# EAGLE design Digit-platus (EAGLE 5.07)
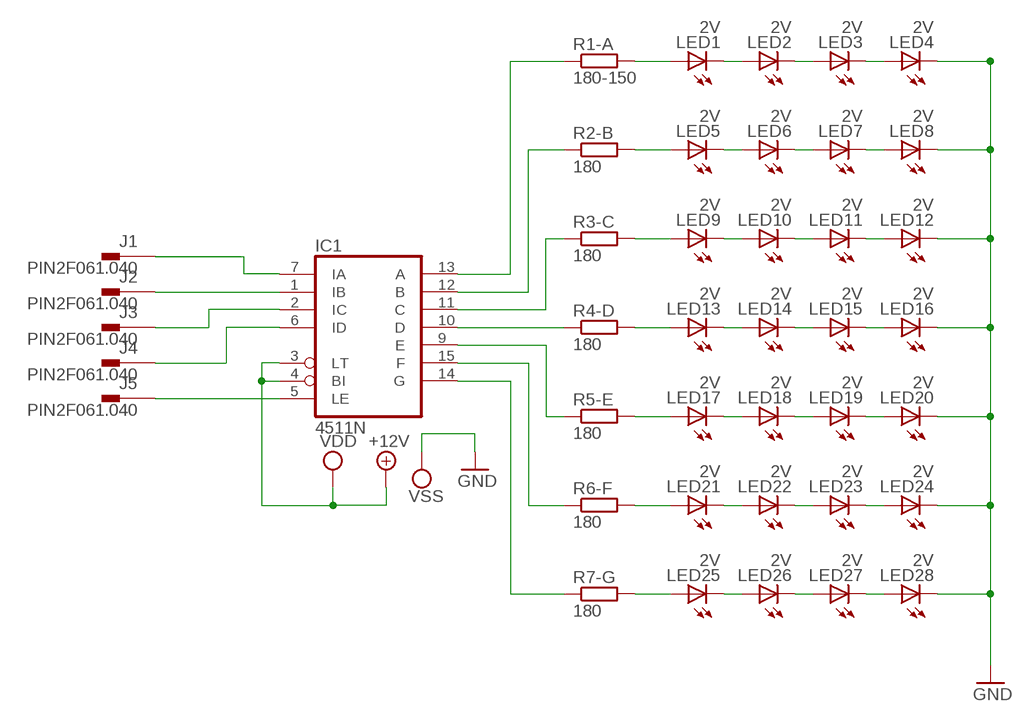
[diagram p0: schematic, sheet 1]

## Parts
IC1  4511N  [DIL16]
J1  PIN2F061.040  [F061.040]
J2  PIN2F061.040  [F061.040]
J3  PIN2F061.040  [F061.040]
J4  PIN2F061.040  [F061.040]
J5  PIN2F061.040  [F061.040]
LED1  2V  LED5MM  [LED5MM]
LED2  2V  LED5MM  [LED5MM]
LED3  2V  LED5MM  [LED5MM]
LED4  2V  LED5MM  [LED5MM]
LED5  2V  LED5MM  [LED5MM]
LED6  2V  LED5MM  [LED5MM]
LED7  2V  LED5MM  [LED5MM]
LED8  2V  LED5MM  [LED5MM]
LED9  2V  LED5MM  [LED5MM]
LED10  2V  LED5MM  [LED5MM]
LED11  2V  LED5MM  [LED5MM]
LED12  2V  LED5MM  [LED5MM]
LED13  2V  LED5MM  [LED5MM]
LED14  2V  LED5MM  [LED5MM]
LED15  2V  LED5MM  [LED5MM]
LED16  2V  LED5MM  [LED5MM]
LED17  2V  LED5MM  [LED5MM]
LED18  2V  LED5MM  [LED5MM]
LED19  2V  LED5MM  [LED5MM]
LED20  2V  LED5MM  [LED5MM]
LED21  2V  LED5MM  [LED5MM]
LED22  2V  LED5MM  [LED5MM]
LED23  2V  LED5MM  [LED5MM]
LED24  2V  LED5MM  [LED5MM]
LED25  2V  LED5MM  [LED5MM]
LED26  2V  LED5MM  [LED5MM]
LED27  2V  LED5MM  [LED5MM]
LED28  2V  LED5MM  [LED5MM]
R1-A  180-150  R-EU_0309/12  [0309/12]
R2-B  180  R-EU_0309/12  [0309/12]
R3-C  180  R-EU_0309/12  [0309/12]
R4-D  180  R-EU_0309/12  [0309/12]
R5-E  180  R-EU_0309/12  [0309/12]
R6-F  180  R-EU_0309/12  [0309/12]
R7-G  180  R-EU_0309/12  [0309/12]

## Nets
+12V: IC1.3(LT) IC1.4(BI) ; supply symbol labelled VDD
GND: LED4.K(C) LED8.K(C) LED12.K(C) LED16.K(C) LED20.K(C) LED24.K(C) LED28.K(C) ; supply symbol labelled VSS
N$1: LED1.A R1-A.2
N$2: LED1.K(C) LED2.A
N$3: LED2.K(C) LED3.A
N$4: LED3.K(C) LED4.A
N$5: LED5.A R2-B.2
N$6: LED5.K(C) LED6.A
N$7: LED6.K(C) LED7.A
N$8: LED7.K(C) LED8.A
N$9: LED9.A R3-C.2
N$10: LED9.K(C) LED10.A
N$11: LED10.K(C) LED11.A
N$12: LED11.K(C) LED12.A
N$13: LED13.A R4-D.2
N$14: LED13.K(C) LED14.A
N$15: LED14.K(C) LED15.A
N$16: LED15.K(C) LED16.A
N$17: LED17.A R5-E.2
N$18: LED17.K(C) LED18.A
N$19: LED18.K(C) LED19.A
N$20: LED19.K(C) LED20.A
N$21: LED21.A R6-F.2
N$22: LED21.K(C) LED22.A
N$23: LED22.K(C) LED23.A
N$24: LED23.K(C) LED24.A
N$25: LED25.A R7-G.2
N$26: LED25.K(C) LED26.A
N$27: LED26.K(C) LED27.A
N$28: LED27.K(C) LED28.A
N$29: IC1.13(A) R1-A.1
N$30: IC1.12(B) R2-B.1
N$31: IC1.11(C) R3-C.1
N$32: IC1.10(D) R4-D.1
N$33: IC1.9(E) R5-E.1
N$34: IC1.15(F) R6-F.1
N$35: IC1.14(G) R7-G.1
N$36: IC1.1(IB) J2.A1
N$37: IC1.7(IA) J1.A1
N$38: IC1.5(LE) J5.A1
N$39: IC1.2(IC) J3.A1
N$40: IC1.6(ID) J4.A1
Unconnected: J1.A2(1.1) J2.A2(1.1) J3.A2(1.1) J4.A2(1.1) J5.A2(1.1)

## Power pins joined to a net without a drawn wire
+12V: IC1.16(VDD)
GND: IC1.8(VSS)

## Library data of the parts
IC1 = 45xx:4511: BCD to 7-segment LATCH/DECODER/DRIVER
J1-J5 = con-faston:PIN2: Flachstecker Typ Tyco/Electronics/AMP TAB, FASTON Printed Circuit Board Tabs Source: http://www.buerklin.com, http://catalog.tycoelectronics.com
LED1-LED28 = led:LED: LED OSRAM: - CHIPLED LG R971, LG N971, LY N971, LG Q971, LY Q971, LO R971, LY R971 LH N974, LH R974 LS Q976, LO Q976, LY Q976 LO Q996 - Hyper CHIPLED LW Q18S LB Q993, LB Q99A, LB R99A - SideLED LS A670, LO A670, LY A670, LG A670, LP A670 LB A673, LV A673, LT A673, LW A673 LH A674 LY A675 LS A676, LA A676, LO A676, LY A676, LW A676 LS A679, LY A679, LG A679 - Hyper Micro SIDELED® LS Y876, LA Y876, LO Y876, LY Y876 LT Y87S - SmartLED LW L88C, LW L88S LB L89C, LB L89S, LG L890 LS L89K, LO L89K, LY L89K LS L896, LA L896, LO L896, LY L896 - TOPLED LS T670, LO T670, LY T670, LG T670, LP T670 LSG T670, LSP T670, LSY T670, LOP T670, LYG T670 LG T671, LOG T671, LSG T671 LB T673, LV T673, LT T673, LW T673 LH T674 LS T676, LA T676, LO T676, LY T676, LB T676, LH T676, LSB T676, LW T676 LB T67C, LV T67C, LT T67C, LS T67K, LO T67K, LY T67K, LW E67C LS E67B, LA E67B, LO E67B, LY E67B, LB E67C, LV E67C, LT E67C LW T67C LS T679, LY T679, LG T679 LS T770, LO T770, LY T770, LG T770, LP T770 LB T773, LV T773, LT T773, LW T773 LH T774 LS E675, LA E675, LY E675, LS T675 LS T776, LA T776, LO T776, LY T776, LB T776 LHGB T686 LT T68C, LB T68C - Hyper Mini TOPLED® LB M676 - Mini TOPLED Santana® LG M470 LS M47K, LO M47K, LY M47K Source: http://www.osram.convergy.de LUXEON: - LUMILED® LXK2-PW12-R00, LXK2-PW12-S00, LXK2-PW14-U00, LXK2-PW14-V00 LXK2-PM12-R00, LXK2-PM12-S00, LXK2-PM14-U00 LXK2-PE12-Q00, LXK2-PE12-R00, LXK2-PE12-S00, LXK2-PE14-T00, LXK2-PE14-U00 LXK2-PB12-K00, LXK2-PB12-L00, LXK2-PB12-M00, LXK2-PB14-N00, LXK2-PB14-P00, LXK2-PB14-Q00 LXK2-PR12-L00, LXK2-PR12-M00, LXK2-PR14-Q00, LXK2-PR14-R00 LXK2-PD12-Q00, LXK2-PD12-R00, LXK2-PD12-S00 LXK2-PH12-R00, LXK2-PH12-S00 LXK2-PL12-P00, LXK2-PL12-Q00, LXK2-PL12-R00 Source: www.luxeon.com KINGBRIGHT: KA-3528ASYC Source: www.kingbright.com
R1-A R2-B R3-C R4-D R5-E R6-F R7-G = ~~rcl:R-EU_: RESISTOR, European symbol

## Board
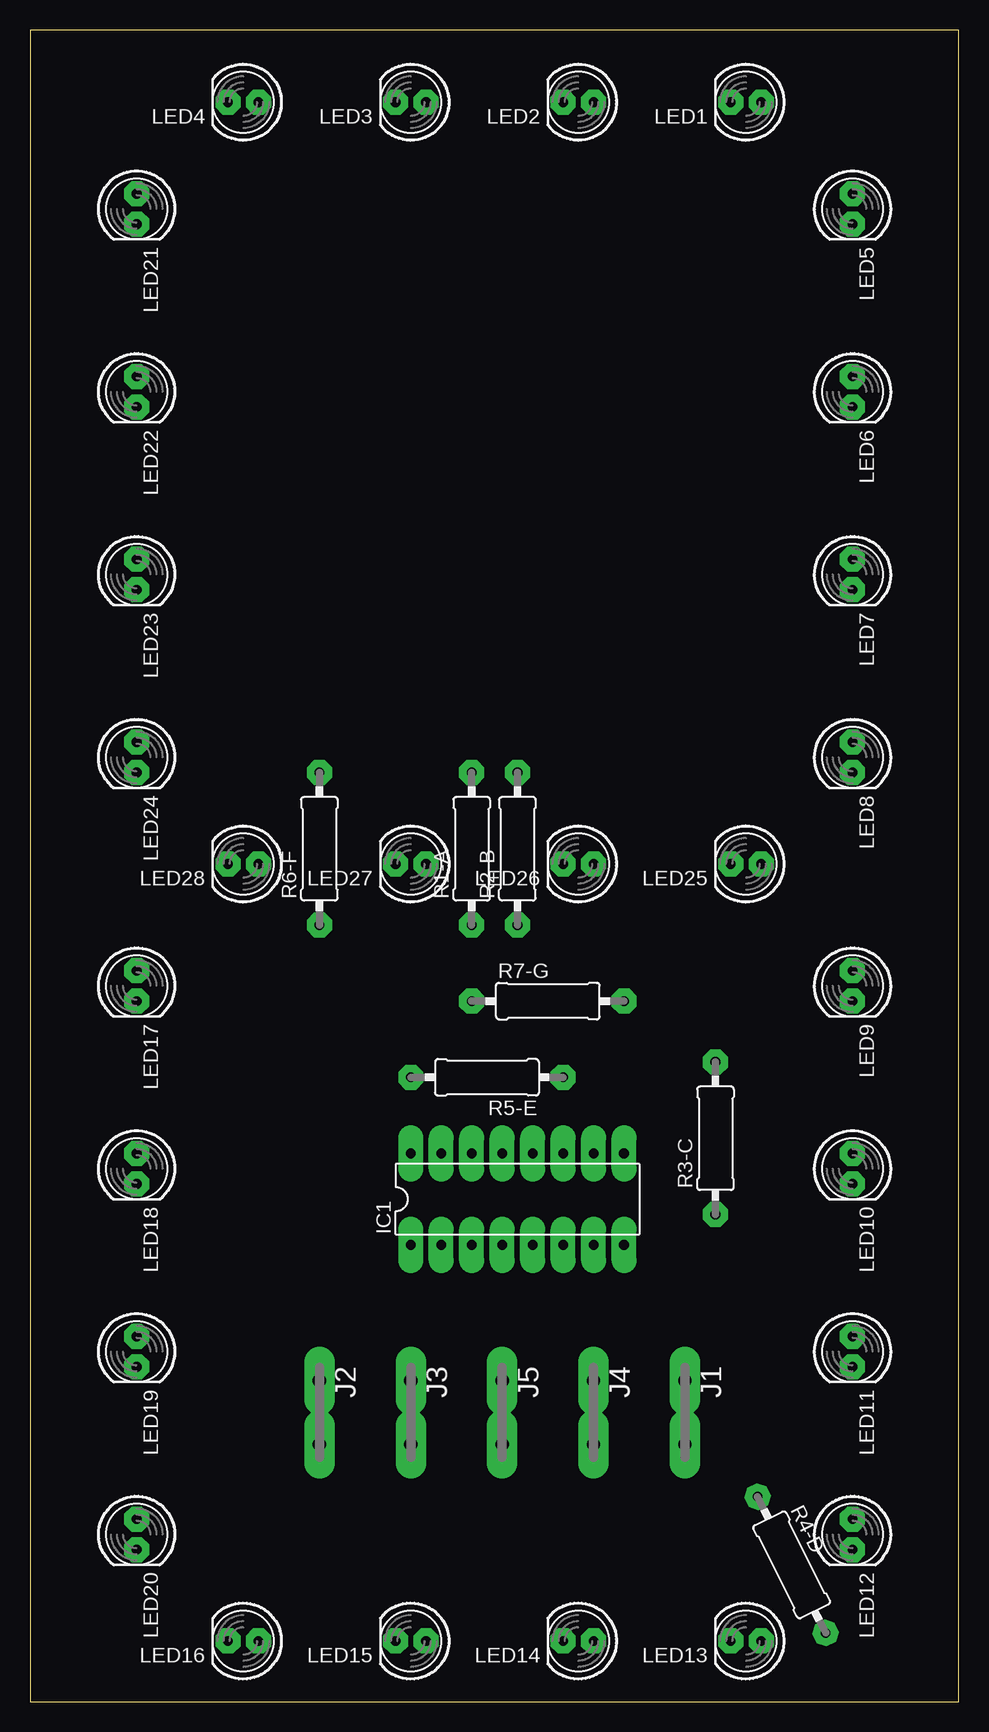
[diagram p1: board, top side]
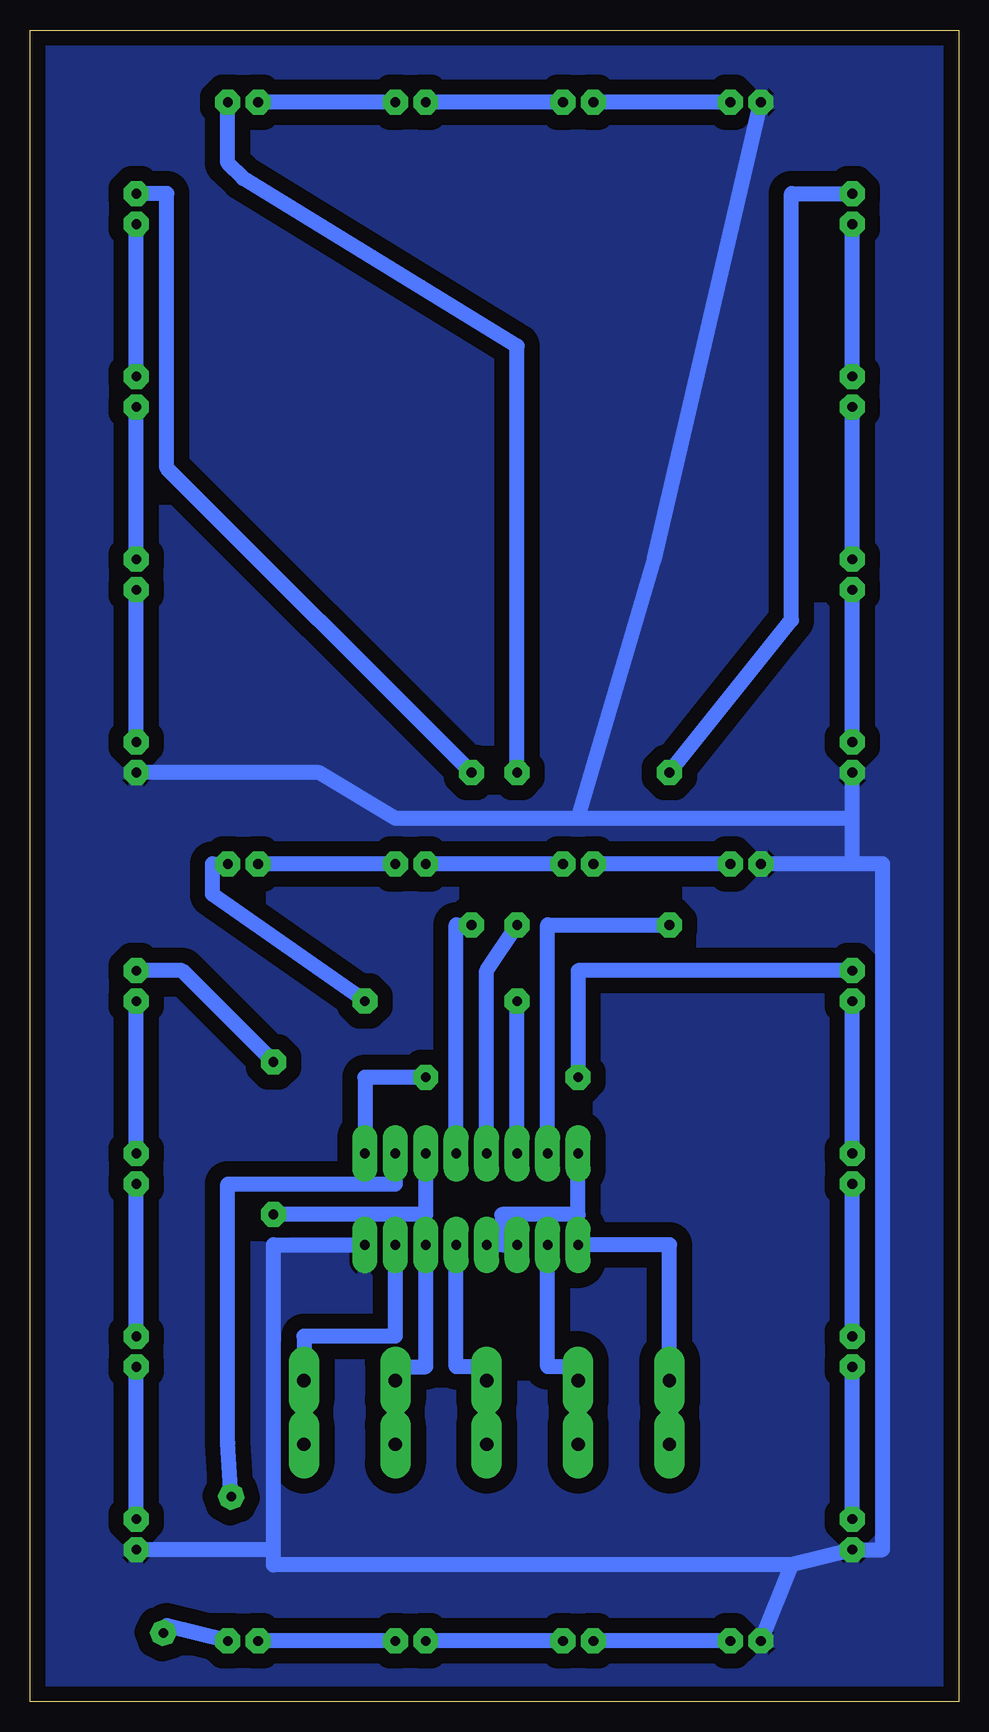
[diagram p2: board, bottom side, seen from below]

Size 77.45 x 139.37 mm. Coordinates in mm from the lower left corner, seen from the top.
Outline: 0,0 77.45,0 77.45,139.37 0,139.37 0,0
Copper layers (1*16): Top 0.035mm / dielectric 1.5mm / Bottom 0.035mm
Design rules "mano bandymas *": minimum track width 50mil, minimum drill 24mil, track to track 8mil, track to pad 8mil, pad to pad 8mil, via to via 8mil, smd to smd 8mil, copper to edge 40mil, drill to drill 8mil, minimum pad ring 25mil, minimum via ring 28mil, stop-mask expansion 4mil, vias tented up to drill 0mil, thermal gap 10mil

### Footprints (pad centres in the part's own frame; a part is rotated, then mirrored left to right if it is on the bottom)
DIL16 = drill 0.813 long: 1 -8.89,-3.81; 2 -6.35,-3.81; 3 -3.81,-3.81; 4 -1.27,-3.81; 5 1.27,-3.81; 6 3.81,-3.81; 7 6.35,-3.81; 8 8.89,-3.81; 9 8.89,3.81; 10 6.35,3.81; 11 3.81,3.81; 12 1.27,3.81; 13 -1.27,3.81; 14 -3.81,3.81; 15 -6.35,3.81; 16 -8.89,3.81
F061.040 = drill 1.1 pad 2.54 long: A1 -2.65,0; A2 2.65,0
LED5MM = drill 0.813 octagon: A -1.27,0; K 1.27,0
0309/12 = drill 0.813 octagon: 1 -6.35,0; 2 6.35,0

### Placement (x,y rotation side)
IC1  40.64,41.91 0 top
J1  54.61,24.13 270 top
J2  24.13,24.13 270 top
J3  31.75,24.13 270 top
J4  46.99,24.13 270 top
J5  39.37,24.13 270 top
LED1  59.69,133.35 180 top
LED2  45.72,133.35 180 top
LED3  31.75,133.35 180 top
LED4  17.78,133.35 180 top
LED5  68.58,124.46 270 top
LED6  68.58,109.22 270 top
LED7  68.58,93.98 270 top
LED8  68.58,78.74 270 top
LED9  68.58,59.69 270 top
LED10  68.58,44.45 270 top
LED11  68.58,29.21 270 top
LED12  68.58,13.97 270 top
LED13  59.69,5.08 180 top
LED14  45.72,5.08 180 top
LED15  31.75,5.08 180 top
LED16  17.78,5.08 180 top
LED17  8.89,59.69 270 top
LED18  8.89,44.45 270 top
LED19  8.89,29.21 270 top
LED20  8.89,13.97 270 top
LED21  8.89,124.46 270 top
LED22  8.89,109.22 270 top
LED23  8.89,93.98 270 top
LED24  8.89,78.74 270 top
LED25  59.69,69.85 180 top
LED26  45.72,69.85 180 top
LED27  31.75,69.85 180 top
LED28  17.78,69.85 180 top
R1-A  36.83,71.12 90 top
R2-B  40.64,71.12 90 top
R3-C  57.15,46.99 90 top
R4-D  63.5,11.43 296.5 top
R5-E  38.1,52.07 180 top
R6-F  24.13,71.12 90 top
R7-G  43.18,58.42 0 top

### Tracks (layer width: path | path; a pad name or v marks a point on that pad's centre or on a via)
+12V
  Bottom 1.27: 38.1,38.1 IC1.4 | 38.1,38.1 IC1.3 | IC1.16 31.75,40.64 38.1,40.64 38.1,38.1
GND
  Bottom 1.27: 13.97,11.43 LED20.K 6.35,12.7 6.35,69.85 8.89,69.85 | 13.97,11.43 LED16.K | 57.15,12.7 LED12.K | 13.97,11.43 57.15,11.43 57.15,12.7 | IC1.8 57.15,38.1 57.15,12.7 | 8.89,69.85 LED28.K | LED8.K 53.34,77.47 46.99,73.66 31.75,73.66 | 8.89,73.66 31.75,73.66 | 8.89,69.85 8.89,73.66 | 8.89,73.66 LED24.K | LED4.K 25.4,95.25 31.75,73.66
  pour Bottom (isolate 1.27): 1.27,1.27 76.2,1.27 76.2,138.43 1.27,138.43
N$1
  Bottom 1.27: R1-A.2 36.83,113.03 59.69,127 60.96,128.27 LED1.A
N$2
  Bottom 1.27: LED2.A LED1.K
N$3
  Bottom 1.27: LED3.A LED2.K
N$4
  Bottom 1.27: LED4.A LED3.K
N$5
  Bottom 1.27: R2-B.2 66.04,102.87 66.04,125.73 LED5.A
N$6
  Bottom 1.27: LED6.A LED5.K
N$7
  Bottom 1.27: LED7.A LED6.K
N$8
  Bottom 1.27: LED8.A LED7.K
N$9
  Bottom 1.27: R3-C.2 64.77,60.96 LED9.A
N$10
  Bottom 1.27: LED10.A LED9.K
N$11
  Bottom 1.27: LED11.A LED10.K
N$12
  Bottom 1.27: LED12.A LED11.K
N$13
  Bottom 1.27: LED13.A 66.04,6.35 R4-D.2
N$14
  Bottom 1.27: LED14.A LED13.K
N$15
  Bottom 1.27: LED15.A LED14.K
N$16
  Bottom 1.27: LED16.A LED15.K
N$17
  Bottom 1.27: LED17.A 31.75,60.96 R5-E.2
N$18
  Bottom 1.27: LED18.A LED17.K
N$19
  Bottom 1.27: LED19.A LED18.K
N$20
  Bottom 1.27: LED20.A LED19.K
N$21
  Bottom 1.27: R6-F.2 13.97,90.17 13.97,125.73 LED21.A
N$22
  Bottom 1.27: LED22.A LED21.K
N$23
  Bottom 1.27: LED23.A LED22.K
N$24
  Bottom 1.27: LED24.A LED23.K
N$25
  Bottom 1.27: R7-G.2 62.23,67.31 62.23,69.85 LED25.A
N$26
  Bottom 1.27: LED26.A LED25.K
N$27
  Bottom 1.27: LED27.A LED26.K
N$28
  Bottom 1.27: LED28.A LED27.K
N$29
  Bottom 1.27: IC1.13 39.37,60.96 R1-A.1
N$30
  Bottom 1.27: IC1.12 41.91,64.77 R2-B.1
N$31
  Bottom 1.27: IC1.11 44.45,40.64 R3-C.1
N$32
  Bottom 1.27: IC1.10 46.99,43.18 60.96,43.18 60.96,21.59 R4-D.1
N$33
  Bottom 1.27: R5-E.1 49.53,52.07 IC1.9
N$34
  Bottom 1.27: IC1.15 34.29,64.77 R6-F.1
N$35
  Bottom 1.27: IC1.14 R7-G.1
N$36
  Bottom 1.27: IC1.1 24.13,38.1 J2.A1
N$37
  Bottom 1.27: IC1.7 46.99,30.48 54.61,30.48 J1.A1
N$38
  Bottom 1.27: IC1.5 41.91,27.94 39.37,27.94 J5.A1
N$39
  Bottom 1.27: IC1.2 34.29,27.94 31.75,27.94 J3.A1
N$40
  Bottom 1.27: IC1.6 44.45,27.94 46.99,27.94 J4.A1